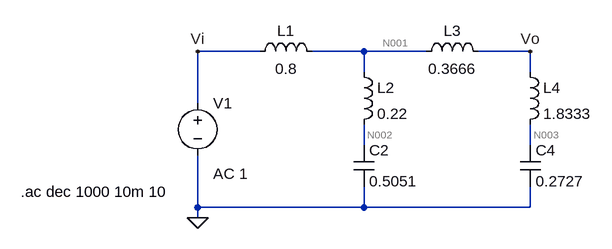
[diagram p0: schematic ej2.asc]
ej2.asc, the LTspice schematic file:
Version 4
SHEET 1 880 680
WIRE 112 128 16 128
WIRE 272 128 192 128
WIRE 368 128 272 128
WIRE 528 128 448 128
WIRE 272 160 272 128
WIRE 528 160 528 128
WIRE 16 208 16 128
WIRE 272 272 272 240
WIRE 528 272 528 240
WIRE 16 368 16 288
WIRE 272 368 272 336
WIRE 272 368 16 368
WIRE 528 368 528 336
WIRE 528 368 272 368
WIRE 16 384 16 368
FLAG 16 384 0
FLAG 16 128 Vi
FLAG 528 128 Vo
SYMBOL ind 96 144 R270
WINDOW 0 32 56 VTop 2
WINDOW 3 5 56 VBottom 2
SYMATTR InstName L1
SYMATTR Value 0.8
SYMATTR SpiceLine Rser=0
SYMBOL ind 256 144 R0
SYMATTR InstName L2
SYMATTR Value 0.22
SYMATTR SpiceLine Rser=0
SYMBOL ind 352 144 R270
WINDOW 0 32 56 VTop 2
WINDOW 3 5 56 VBottom 2
SYMATTR InstName L3
SYMATTR Value 0.3666
SYMATTR SpiceLine Rser=0
SYMBOL ind 512 144 R0
SYMATTR InstName L4
SYMATTR Value 1.8333
SYMATTR SpiceLine Rser=0
SYMBOL cap 256 272 R0
SYMATTR InstName C2
SYMATTR Value 0.5051
SYMBOL cap 512 272 R0
SYMATTR InstName C4
SYMATTR Value 0.2727
SYMBOL voltage 16 192 R0
WINDOW 123 24 124 Left 2
WINDOW 39 0 0 Left 0
SYMATTR Value2 AC 1
SYMATTR InstName V1
SYMATTR Value ""
TEXT -256 344 Left 2 !.ac dec 1000 10m 10

The netlist it stands for:
* ej2.asc
L1 Vi N001 0.8 Rser=0
L2 N001 N002 0.22 Rser=0
L3 N001 Vo 0.3666 Rser=0
L4 Vo N003 1.8333 Rser=0
C2 N002 0 0.5051
C4 N003 0 0.2727
V1 Vi 0 AC 1
.ac dec 1000 10m 10
.backanno
.end

* Results of the author's LTspice run, read from the files saved beside the schematic
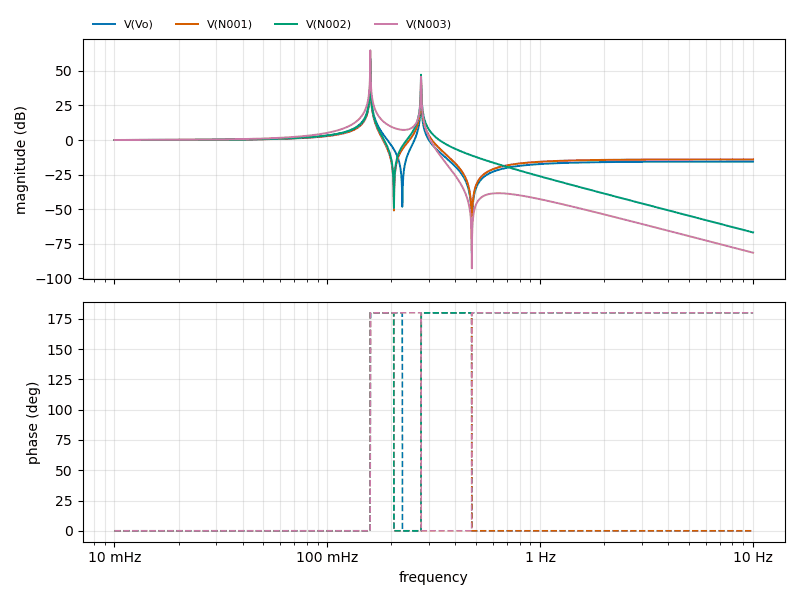
[diagram p1: AC Analysis of ej2.asc, plotted from the saved traces]
* AC Analysis, 1 run:
*   V(Vo): 0.02 dB at 10 mHz, -15.58 dB at 10 Hz, peak 58.83 dB at 159.2 mHz, 3 dB below the peak at 159.1 mHz and 159.3 mHz
*   V(N001): 0.02 dB at 10 mHz, -13.99 dB at 10 Hz, peak 56.89 dB at 159.2 mHz, 3 dB below the peak at 159.1 mHz and 159.3 mHz
*   V(N002): 0.03 dB at 10 mHz, -66.82 dB at 10 Hz, peak 57.91 dB at 159.2 mHz, 3 dB below the peak at 159.1 mHz and 159.3 mHz
*   V(N003): 0.04 dB at 10 mHz, -81.48 dB at 10 Hz, peak 64.85 dB at 159.2 mHz, 3 dB below the peak at 159.1 mHz and 159.3 mHz